# Altium schematic sheet buck_boost_schematic.SchDoc
size A4
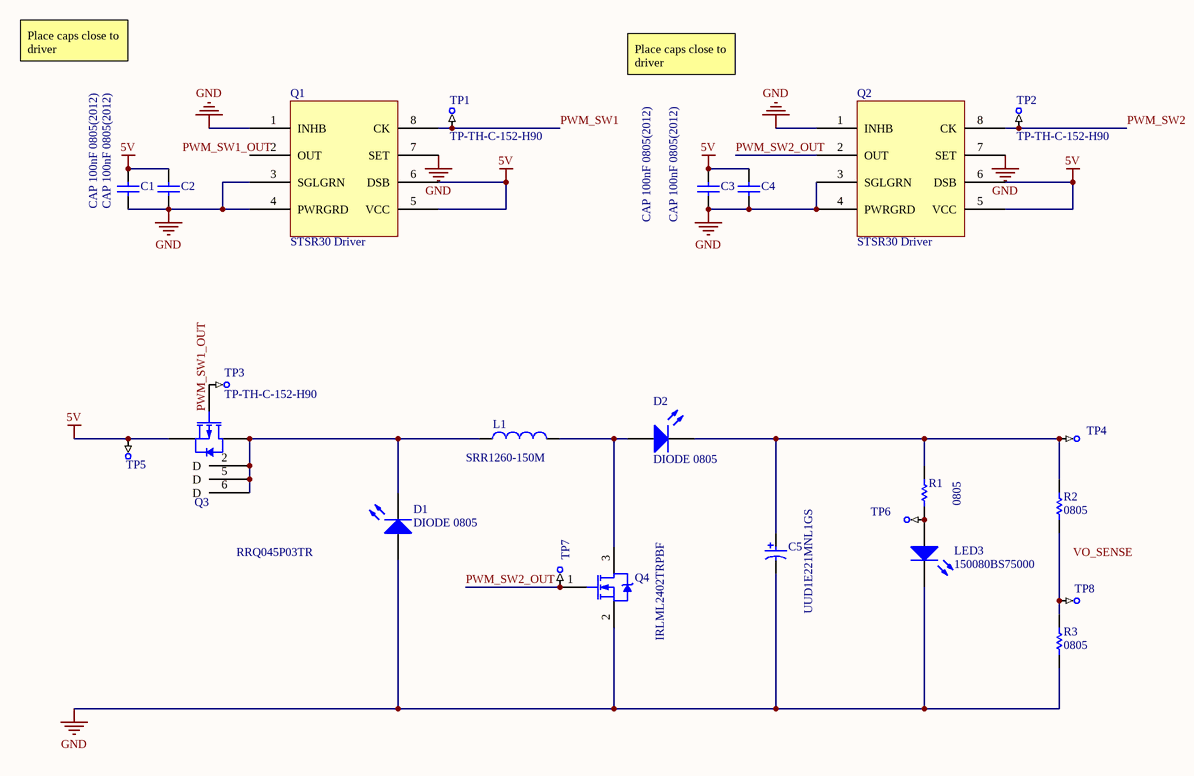
[diagram p0: buck_boost_schematic.SchDoc]

## Parts
C1  CAP 100nF 0805(2012)  [CAPC0805(2012)100_L]
C2  CAP 100nF 0805(2012)  [CAPC0805(2012)100_L]
C3  CAP 100nF 0805(2012)  [CAPC0805(2012)100_L]
C4  CAP 100nF 0805(2012)  [CAPC0805(2012)100_L]
C5  UUD1E221MNL1GS  [NIC-CAPA2-8X10_V]
D1  DIODE 0805  [0805_A]
D2  DIODE 0805  [0805_A]
L1  SRR1260-150M  [BOUR-SRR1260_V]
LED3  150080BS75000  [0805_A]
Q1  STSR30 Driver  [NXP-SOT96-1_L]
Q2  STSR30 Driver  [NXP-SOT96-1_L]
Q3  RRQ045P03TR  [DDC0006A_L]
Q4  IRLML2402TRPBF  [INTR-IRLML2402TRPBF-3_V]
R1  0805  [RESC0805(2012)_N]
R2  0805  [RESC0805(2012)_N]
R3  0805  [RESC0805(2012)_N]
TP1  TP-TH-C-152-H90  [TP-TH-C-152-H90]  (no BOM)
TP2  TP-TH-C-152-H90  [TP-TH-C-152-H90]  (no BOM)
TP3  TP-TH-C-152-H90  [TP-TH-C-152-H90]  (no BOM)
TP4  (no value)  [TP-TH-C-152-H90]  (no BOM)
TP5  (no value)  [TP-TH-C-152-H90]  (no BOM)
TP6  (no value)  [TP-TH-C-152-H90]  (no BOM)
TP7  (no value)  [TP-TH-C-152-H90]  (no BOM)
TP8  (no value)  [TP-TH-C-152-H90]  (no BOM)

## Nets
5V: C1.2 C2.2 C3.2 C4.2 Q1.5(VCC) Q1.6(DSB) Q2.5(VCC) Q2.6(DSB) Q3.4(S) TP5.1
GND: C1.1 C2.1 C3.1 C4.1 C5.2 D1.2(A) LED3.1(K) Q1.1(INHB) Q1.3(SGLGRN) Q1.4(PWRGRD) Q1.7(SET) Q2.1(INHB) Q2.3(SGLGRN) Q2.4(PWRGRD) Q2.7(SET) Q4.2(S) R3.1
PWM_SW1: Q1.8(CK) TP1.1
PWM_SW2: Q2.8(CK) TP2.1
PWM_SW2_OUT: Q2.2(OUT) Q4.1(G) TP7.1
NetC5_1: C5.1 D2.1(K) R1.2 R2.2 TP4.1
NetD1_1: D1.1(K) L1.1 Q3.1(D) Q3.2(D) Q3.5(D) Q3.6(D)
NetD2_2: D2.2(A) L1.2 Q4.3(D)
NetLED3_2: LED3.2(A) R1.1 TP6.1
NetQ3_3: Q3.3(G) TP3.1
NetR2_1: R2.1 R3.2 TP8.1

Not connected (* = marked no-connect by the designer): Q1 2(OUT)

## Notes on the sheet
- Place caps close to driver
- Labels drawn without touching a wire or pin: PWM_SW1_OUT, VO_SENSE

## Library data of the parts
C1-C4 = CMP-1036-04519-1: CAP 220nF 6.3V ±10% 0805 (2012 Metric) Thickness 1mm SMD; Case-EIA: 0805; Tolerance: Â±10%; Case-Metric: 2012; Max Thickness: 1 mm; Value: 220nF; Rated Voltage: 6.3 V; Technology: SMT
C5 = CMP-0687-00079-1: Aluminum Electrolytic Capacitor, UD Series, Low Impedance, 220 uF, 25 V, + / - 20%, -55 to 105 degC, Chip Type, 8 x 10 mm D x L, Pb-Free, Reel; Manufacturer: Nichicon; Impedance: 0.17 Ohm; Tolerance Rated Capacitance: -20 to 20%; Packing: Dia382mm Reel; Endurance Time: 5000 h; Rated Voltage: 25 V; Rated Ripple Current (at 100kHz): 450 mA; Rated Capacitance: 220 uF; PartNumber: UUD1E221MNL1GS; DatasheetVersion: 08/2012; ComponentLink1Description: Manufacturer URL; Length: 10 mm; ComponentLink3Description: Package Specification; RoHS: TRUE; ComponentLink2Description: Datasheet; Diameter: 8 mm; ComponentLink2URL: http://products.nichicon.co.jp/en/pdf/XJA043/e-ud.pdf; ComponentLink3URL: http://products.nichicon.co.jp/en/pdf/XJA043/e-ud.pdf; PackageReference: CAPAE-D8H10; ComponentLink1URL: http://www.nichicon.co.jp/; PackageDescription: 2-Pin Surface Mount Device, Diameter 8 mm, Height 10 mm, Pitch 6.5 mm; Mounting Technology: Surface Mount
D1 D2 = CMP-1426-00008-1: SMD mono-color Chip LED, WL-SMCW, Blue; Manufacturer: Wuerth Elektronik; PartNumber: 150080BS75000; Color: Blue; ComponentLink2URL: http://katalog.we-online.com/led/datasheet/150080BS75000.pdf; ComponentLink1URL: http://www.we-online.com; ComponentLink2Description: Datasheet; PackageReference: 0805_A; ComponentLink1Description: Manufacturer URL
L1 = CMP-2000-07146-1: Shielded Power Inductor, 15 uH, +/- 20%, -40 to 125 degC, 2-Pin SMD, RoHS, Tape and Reel; Manufacturer: Bourns; Core Material: Ferrite; Inductance: 15uH; Product Height: 6.5mm; Maximum DC Current: 5A; Maximum DC Resistance: 27mOhm; Minimum Quality Factor: 25(Typ)@2.52MHz; Package Reference: SRR1260; Package Description: 2-Pin Surface Mount Device, Body 12.5 x 12.5 mm; Datasheet URL: http://www.bourns.com/docs/Product-Datasheets/SRR1260.pdf; Mounting Technology: SurfaceMount; Category: InductorSurfaceMount; Package/Case: 12.8X12.8X6.5; Manufacturer URL: http://www.bourns.com/; Datasheet Version: 03/2015; Tolerance: 20%; Type: Power
LED3 = CMP-1426-00008-1: SMD mono-color Chip LED, WL-SMCW, Blue; Manufacturer: Wuerth Elektronik; Color: Blue; ComponentLink2URL: http://katalog.we-online.com/led/datasheet/150080BS75000.pdf; ComponentLink1URL: http://www.we-online.com; ComponentLink2Description: Datasheet; PackageReference: 0805_A; ComponentLink1Description: Manufacturer URL; PartNumber: 150080BS75000
Q1 Q2 = STSR30
Q3 = MOSFET_P - RRQ045P03TR
Q4 = CMP-2000-05155-1: HEXFET(R) Power MOSFET, N-Channel, 20 V, 1.2 A, 3-Pin SOT-23, RoHS, Tape and Reel; Manufacturer: International Rectifier; Voltage Vgs Rds on Measurement: 4.5V; Current Id Max: 1.2A; External Width: 3.05mm; Transistor Polarity: NChannel; No. of Pins: 3; Power Dissipation Pd: 540mW; External Length / Height: 1.12mm; Full Power Rating Temperature: 25degC; On Resistance Rds(on): 250mohm; Voltage Vds Typ: 20V; SMD Marking: 1A; No. of Transistors: 1; Reel Quantity: 3000; External Depth: 2.5mm; Pulse Current Idm: 7.4A; Junction Temperature Tj Min: -55degC; Threshold Voltage Vgs Typ: 700mV; SVHC: NoSVHC(19-Dec-2012); Datasheet URL: https://datasheet.ciiva.com/29326/162826-da-01-en-irlml-2402tr-29326791.pdf; Tape Width: 8mm; Operating Temperature Range: -55degCto+150degC; Manufacturer URL: http://internationalrectifier.com/; Termination Type: SMD; Datasheet Version: Jan-03; Current Temperature: 25degC; Package / Case: SOT-23; Drain Source Voltage Vds: 20V; Rds(on) Test Voltage Vgs: 4.5V; Continuous Drain Current Id: 1.2A; Transistor Case Style: SOT-23; Voltage Vgs th Min: 700mV; Voltage Vgs Max: 700mV
R1-R3 = CMP-1013-00064-1: 390R 0.125W 5% 0805 (2012 Metric)  SMD; Value: 390.00 Ohm; Case-Metric: 2012; Case-EIA: 0805; Power: 0.125 W; Tolerance: 5 %; Technology: SMT
TP1-TP8 = CMP-0484-00003-2: Test Point, Through Hole, Hole Size 0.9 mm, PCB Mount with Silkscreen Box; Manufacturer: No Vendor; PartNumber: TP-TH-C-152-H90